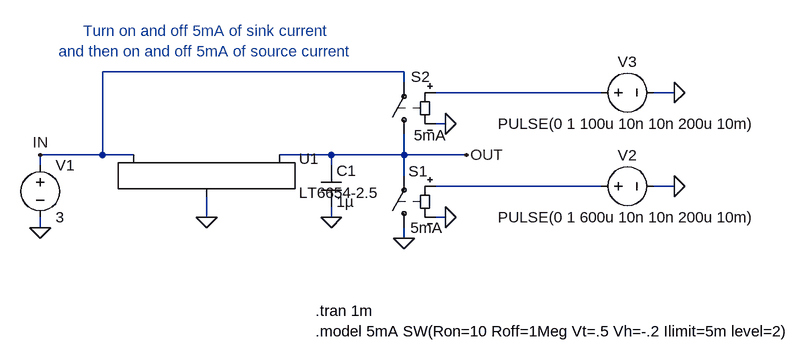
[diagram p0: schematic 6654-2.5.asc]
6654-2.5.asc, the LTspice schematic file:
Version 4
SHEET 1 4212 1120
WIRE 2288 256 1824 256
WIRE 2288 272 2288 256
WIRE 2592 288 2336 288
WIRE 2704 288 2672 288
WIRE 2352 336 2336 336
WIRE 1824 384 1824 256
WIRE 1824 384 1728 384
WIRE 1872 384 1824 384
WIRE 2176 384 2096 384
WIRE 2288 384 2288 352
WIRE 2288 384 2176 384
WIRE 2384 384 2288 384
WIRE 1728 400 1728 384
WIRE 2176 400 2176 384
WIRE 2288 416 2288 384
WIRE 2592 432 2336 432
WIRE 2704 432 2672 432
WIRE 1984 480 1984 448
WIRE 2176 480 2176 464
WIRE 2352 480 2336 480
WIRE 1728 496 1728 480
WIRE 2288 512 2288 496
FLAG 1984 480 0
FLAG 2384 384 OUT
FLAG 1728 384 IN
FLAG 1728 496 0
FLAG 2176 480 0
FLAG 2288 512 0
FLAG 2352 480 0
FLAG 2704 432 0
FLAG 2352 336 0
FLAG 2704 288 0
SYMBOL voltage 1728 384 R0
WINDOW 123 0 0 Left 2
WINDOW 39 0 0 Left 2
SYMATTR InstName V1
SYMATTR Value 3
SYMBOL cap 2160 400 R0
SYMATTR InstName C1
SYMATTR Value 1µ
SYMBOL LT6654-2.5 1984 384 R0
SYMATTR InstName U1
SYMBOL sw 2288 512 R180
WINDOW 0 -7 103 Right 2
WINDOW 3 -10 16 Right 2
SYMATTR InstName S1
SYMATTR Value 5mA
SYMBOL voltage 2576 432 M90
WINDOW 123 74 56 VTop 2
WINDOW 39 53 56 VTop 2
WINDOW 0 -32 56 VBottom 2
WINDOW 3 32 56 VTop 2
SYMATTR InstName V2
SYMATTR Value PULSE(0 1 600u 10n 10n 200u 10m)
SYMBOL sw 2288 368 R180
WINDOW 0 -11 104 Right 2
WINDOW 3 -15 14 Right 2
SYMATTR InstName S2
SYMATTR Value 5mA
SYMBOL voltage 2576 288 M90
WINDOW 123 74 56 VTop 2
WINDOW 39 53 56 VTop 2
WINDOW 3 32 56 VTop 2
WINDOW 0 -32 56 VBottom 2
SYMATTR Value PULSE(0 1 100u 10n 10n 200u 10m)
SYMATTR InstName V3
TEXT 2152 624 Left 2 !.tran 1m\n.model 5mA SW(Ron=10 Roff=1Meg Vt=.5 Vh=-.2 Ilimit=5m level=2)
TEXT 1984 240 Bottom 2 ;Turn on and off 5mA of sink current\nand then on and off 5mA of source current

The netlist it stands for:
* 6654-2.5.asc
V1 IN 0 3
C1 OUT 0 1µ
XU1 0 IN OUT LT6654-2.5
S1 0 OUT N002 0 5mA
V2 N002 0 PULSE(0 1 600u 10n 10n 200u 10m)
S2 OUT IN N001 0 5mA
V3 N001 0 PULSE(0 1 100u 10n 10n 200u 10m)
.tran 1m
.model 5mA SW(Ron=10 Roff=1Meg Vt=.5 Vh=-.2 Ilimit=5m level=2)
* Turn on and off 5mA of sink current
* and then on and off 5mA of source current
.lib LTC2.lib
.backanno
.end